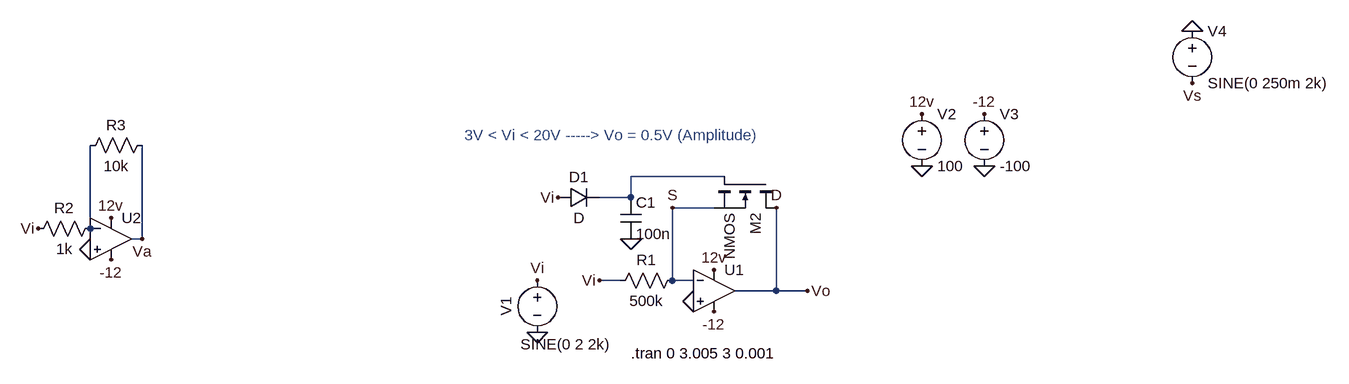
[diagram p0: schematic agc.asc]
agc.asc, the LTspice schematic file:
Version 4
SHEET 1 1556 680
WIRE 608 112 464 112
WIRE 464 144 464 112
WIRE 464 144 416 144
WIRE 592 160 528 160
WIRE -368 192 -368 64
WIRE -288 208 -288 64
WIRE -288 208 -304 208
WIRE 448 272 416 272
WIRE 528 272 528 160
WIRE 560 272 528 272
WIRE 688 288 688 160
WIRE 688 288 624 288
WIRE 736 288 688 288
FLAG 464 208 0
FLAG 320 352 0
FLAG 1008 96 0
FLAG 912 96 0
FLAG 912 16 12v
FLAG 592 256 12v
FLAG 592 320 -12
FLAG 1008 16 -12
FLAG 736 288 Vo
FLAG 320 272 Vi
FLAG 560 304 0
FLAG 416 272 Vi
FLAG 528 160 S
FLAG 688 160 D
FLAG -336 176 12v
FLAG -336 240 -12
FLAG -368 224 0
FLAG -448 192 Vi
FLAG -288 208 Va
FLAG 1328 -32 Vs
FLAG 1328 -112 0
FLAG 352 144 Vi
SYMBOL diode 352 160 R270
WINDOW 0 32 32 VTop 2
WINDOW 3 0 32 VBottom 2
SYMATTR InstName D1
SYMBOL cap 448 144 R0
SYMATTR InstName C1
SYMATTR Value 100n
SYMBOL voltage 320 256 R0
WINDOW 0 -32 56 VBottom 2
WINDOW 3 43 99 Top 2
WINDOW 123 0 0 Left 0
WINDOW 39 0 0 Left 0
SYMATTR InstName V1
SYMATTR Value SINE(0 2 2k)
SYMBOL OpAmps\\UniversalOpAmp 592 288 R0
SYMATTR InstName U1
SYMBOL res 544 256 R90
WINDOW 0 0 56 VBottom 2
WINDOW 3 32 56 VTop 2
SYMATTR InstName R1
SYMATTR Value 500k
SYMBOL voltage 912 0 R0
WINDOW 123 0 0 Left 0
WINDOW 39 0 0 Left 0
SYMATTR InstName V2
SYMATTR Value 100
SYMBOL voltage 1008 0 R0
WINDOW 123 0 0 Left 0
WINDOW 39 0 0 Left 0
SYMATTR InstName V3
SYMATTR Value -100
SYMBOL nmos 688 112 R90
SYMATTR InstName M2
SYMBOL OpAmps\\UniversalOpAmp2 -336 208 R0
SYMATTR InstName U2
SYMBOL res -352 176 R90
WINDOW 0 0 56 VBottom 2
WINDOW 3 32 56 VTop 2
SYMATTR InstName R2
SYMATTR Value 1k
SYMBOL res -272 48 R90
WINDOW 0 0 56 VBottom 2
WINDOW 3 32 56 VTop 2
SYMATTR InstName R3
SYMATTR Value 10k
SYMBOL voltage 1328 -128 R0
WINDOW 123 0 0 Left 0
WINDOW 39 0 0 Left 0
SYMATTR InstName V4
SYMATTR Value SINE(0 250m 2k)
TEXT 464 384 Left 2 !.tran 0 3.005 3 0.001
TEXT 208 48 Left 2 ;3V < Vi < 20V -----> Vo = 0.5V (Amplitude)

The netlist it stands for:
* agc.asc
D1 Vi N001 D
C1 N001 0 100n
V1 Vi 0 SINE(0 2 2k)
XU1 0 S 12v -12 D level1 Avol=1Meg GBW=10Meg Vos=0 En=0 Enk=0 In=0 Ink=0 Rin=500Meg  ; pins In+ In- V+ V- OUT
R1 S Vi 500k
V2 12v 0 100
V3 -12 0 -100
M2 D N001 S S NMOS
XU2 0 N002 12v -12 Va level2 Avol=1Meg GBW=10Meg Slew=10Meg Ilimit=25m Rail=0 Vos=0 En=0 Enk=0 In=0 Ink=0 Rin=500Meg  ; pins In+ In- V+ V- OUT
R2 N002 Vi 1k
R3 Va N002 10k
V4 0 Vs SINE(0 250m 2k)
.model D D
.lib standard.dio
.model NMOS NMOS
.model PMOS PMOS
.lib standard.mos
.tran 0 3.005 3 0.001
* 3V < Vi < 20V -----> Vo = 0.5V (Amplitude)
.lib UniversalOpAmp1.lib
.lib UniversalOpAmp2.lib
.backanno
.end